# Altium schematic sheet ACCIC.SchDoc
size A
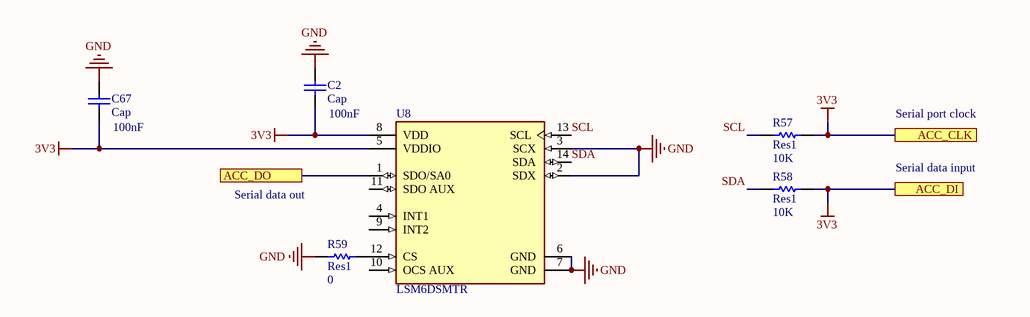
[diagram p0: ACCIC.SchDoc]

## Parts
C2  Cap  value 100nF  [0402]
C67  Cap  value 100nF  [0402]
R57  Res1  value 10K  [0402]
R58  Res1  value 10K  [0402]
R59  Res1  value 0  [0402]
U8  LSM6DSMTR  [FP-LGA-14L-DM00249496-MFG]

## Ports
ACC_CLK, ACC_DI, ACC_DO

## Nets
3V3: C2.2 C67.2 R57.2 R58.2 U8.5(VDDIO) U8.8(VDD) ; port ACC_CLK, port ACC_DI
GND: C2.1 C67.1 R59.1 U8.2(SDX) U8.3(SCX) U8.6(GND) U8.7(GND)
ACC_DO: U8.1(SDO/SA0) ; port ACC_DO
SCL: R57.1 U8.13(SCL)
SDA: R58.1 U8.14(SDA)
NetR59_2: R59.2 U8.12(CS)

Not connected (* = marked no-connect by the designer): U8 4(INT1) 9(INT2) 10(OCS_AUX) 11(SDO_AUX)

## Notes on the sheet
- Serial port clock
- Serial data out
- Serial data input

## Library data of the parts
C2 C67 = Cap: Capacitor; Published: 8-Jun-2000; LatestRevisionDate: 17-Jul-2002; LatestRevisionNote: Re-released for DXP Platform.; PackageReference: RAD-0.3; Publisher: Altium Limited; PackageDescription: Radial Cap, Thru-Hole; 2 Leads; 0.3 in Pin Spacing
R57-R59 = Res1: Resistor; Published: 8-Jun-2000; LatestRevisionDate: 17-Jul-2002; LatestRevisionNote: Re-released for DXP Platform.; PackageReference: AXIAL-0.3; Publisher: Altium Limited; PackageDescription: Axial Device, Thru-Hole; 2 Leads; 0.3 in Pin Spacing
U8 = CMP-12177-000008-1: IMU ACCEL/GYRO I2C/SPI 14LGA; Manufacturer: STMicroelectronics; Operating Supply Current: 0.29-0.65mA; Gyro Range: 125/250/500/1000/2000°/s; Sensor Output: I2C,SPI; Accel Range: 2/4/8/16g; Min Supply Voltage: 1.62V; Resolution: 16bits; Sensor Type: Temperature,Accelerometer,Gyroscope; Max Supply Voltage: 3.6V; Manufacturer Part Number: LSM6DSMTR; Octopart: https://octopart.com/lsm6dsmtr-stmicroelectronics-66358194; Height: 0.86mm; Category: IC; Lead Free: Yes; Temperature: -40°C to +85°C; Temperature Range Low: -40°C; ComponentLink2Description: Datasheet; ComponentLink2URL: https://www.st.com/resource/en/datasheet/lsm6dsm.pdf; Digikey Description: IMU ACCEL/GYRO I2C/SPI 14LGA; Footprint Url: https://www.st.com/content/ccc/resource/technical/document/technical_note/73/17/9c/16/dd/96/4a/01/CD00134799.pdf/files/CD00134799.pdf/jcr:content/translations/en.CD00134799.pdf; Device Class L1: Sensors; Device Class L2: Motion Sensors; Temperature Range High: +85°C; Mouser Description: LSM6DSM Series 3.6 V I2C/SPI 3D Accelerometer and 3D Gyroscope - LGA-14; Device Class L3: Inertial Measurement Units (IMUs); Automotive: No; Package: LGA-14L-DM00249496; RoHS: TRUE